# Altium schematic sheet Arduino_Uno_Custom_Schematic.SchDoc (part 2 of 4)
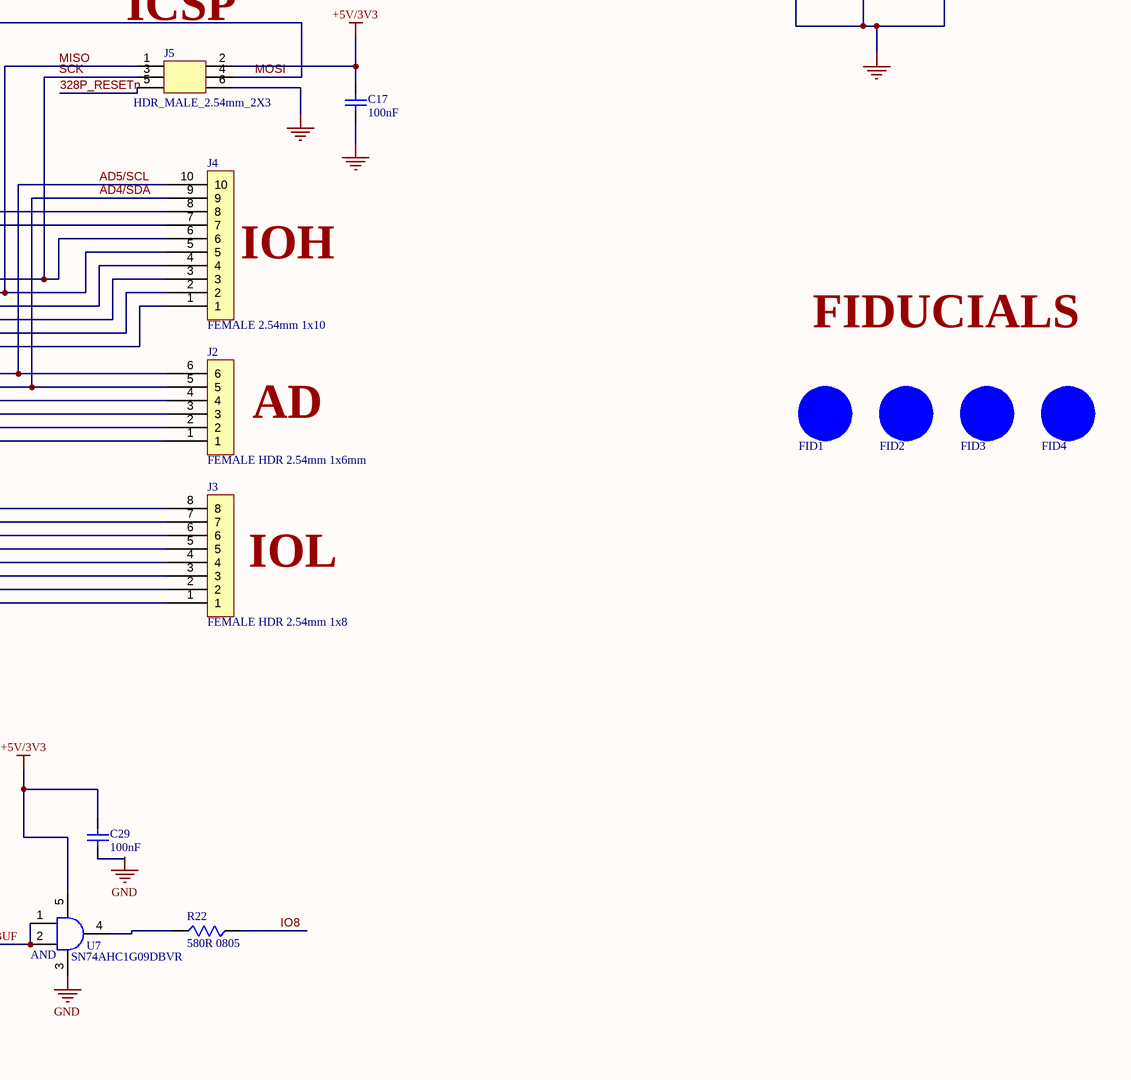
[diagram p4: Arduino_Uno_Custom_Schematic.SchDoc, bottom right]
## Library data of the parts
C1 C2 = EEE-1AA101WR: Radial Can - SMD ALUMINUM ELECTROLYTIC CAPACITOR S 10V 100muF ±20% 0.197Dia 5.00mm; Manufacturer: Panasonic; Manufacturer Lifecycle Status: NRFND; Value: 100µF; Dissipation Factor: 30%; Leakage Current: 10µA; Life (Hours): 1000hours; Ripple Current: 54mA; Ripple Current (AC): 50mA; Supplier: DigiKey; Supplier Part Number: PCE3867CT-ND; Manufacturer Part Number: EEE-1AA101WR; RoHS: Compliant; Category: Aluminum Electrolytic Capacitors; Stock: 21585; Pricing: 1=0.37, 10=0.228, 50=0.1668, 100=0.1474, 500=0.1137 (USD); Case/Package: Radial; Contact Plating: Tin; Country of Origin: Japan, Malaysia; Diameter: 5mm; Export Control Classification Number (ECCN) Code: EAR99; Height: 5.4mm; Height - Seated (Max): 5.4102mm; Harmonized Tariff Schedule (HTS) Code: 8532.22.00.20; Introduction Date: 2004-07-05; Lead Free: Lead Free; Length: 5.4mm; Lifecycle Status: NRND; Max Operating Temperature: 85°C; Min Operating Temperature: -40°C; Mounting Technology: Surface Mount; Number of Terminals: 2; Packaging: Cut Tape; Radiation Hardening: No; Ratings: AEC-Q200; REACH SVHC: Yes; Schedule B: 8532220020, 8532220020|8532220020|8532220020|8532220020|8532220020; Part Series: S; Termination: SMD/SMT; Tolerance: 20%; Voltage Rating: 10V; Voltage Rating (DC): 10V; Width: 5.3mm; ComponentLink1URL: https://datasheet.octopart.com:443/EEE-1AA101WR-Panasonic-datasheet-62330071.pdf?src-supplier=Newark; ComponentLink1Description: https://datasheet.octopart.com:443/EEE-1AA101WR-Panasonic-datasheet-62330071.pdf?src-supplier=Newark; ComponentLink2URL: https://datasheet.octopart.com:443/EEE-1AA101WR-Panasonic-datasheet-5314063.pdf?src-supplier=Newark; ComponentLink2Description: https://datasheet.octopart.com:443/EEE-1AA101WR-Panasonic-datasheet-5314063.pdf?src-supplier=Newark; ComponentLink3URL: https://datasheet.octopart.com:443/EEE-1AA101WR-Panasonic-datasheet-41169183.pdf?src-supplier=Newark; ComponentLink3Description: https://datasheet.octopart.com:443/EEE-1AA101WR-Panasonic-datasheet-41169183.pdf?src-supplier=Newark; ComponentLink4URL: https://datasheet.octopart.com:443/EEE-1AA101WR-Panasonic-datasheet-13265900.pdf?src-supplier=RS+(Formerly+Allied+Electronics); ComponentLink4Description: https://datasheet.octopart.com:443/EEE-1AA101WR-Panasonic-datasheet-13265900.pdf?src-supplier=RS+(Formerly+Allied+Electronics); ComponentLink5URL: https://datasheet.octopart.com:443/EEE-1AA101WR-Panasonic-datasheet-34230028.pdf?src-supplier=element14+APAC; ComponentLink5Description: https://datasheet.octopart.com:443/EEE-1AA101WR-Panasonic-datasheet-34230028.pdf?src-supplier=element14+APAC; ComponentLink6URL: https://datasheet.octopart.com:443/EEE-1AA101WR-Panasonic-datasheet-154766114.pdf?src-supplier=Master+Electronics; ComponentLink6Description: https://datasheet.octopart.com:443/EEE-1AA101WR-Panasonic-datasheet-154766114.pdf?src-supplier=Master+Electronics; ComponentLink7URL: https://datasheet.octopart.com:443/EEE-1AA101WR-Panasonic-datasheet-11548988.pdf?src-supplier=Arrow+Electronics; ComponentLink7Description: https://datasheet.octopart.com:443/EEE-1AA101WR-Panasonic-datasheet-11548988.pdf?src-supplier=Arrow+Electronics; ComponentLink8URL: https://datasheet.octopart.com:443/EEE1AA101WR-Panasonic-datasheet-150469818.pdf?src-supplier=TME; ComponentLink8Description: https://datasheet.octopart.com:443/EEE1AA101WR-Panasonic-datasheet-150469818.pdf?src-supplier=TME; ComponentLink9URL: https://sigma.octopart.com:443/150570760/technical_drawing/Panasonic-EEE1AA101WR.pdf?src-supplier=Panasonic+SCT; ComponentLink9Description: https://sigma.octopart.com:443/150570760/technical_drawing/Panasonic-EEE1AA101WR.pdf?src-supplier=Panasonic+SCT; ComponentLink10URL: https://datasheet.octopart.com:443/EEE-1AA101WR-Panasonic-datasheet-6019.pdf?src-supplier=DigiKey; ComponentLink10Description: https://datasheet.octopart.com:443/EEE-1AA101WR-Panasonic-datasheet-6019.pdf?src-supplier=DigiKey
C3 C7 C12 C13 C19 C21 C22 C34 = C2012X5R1C106K085AC: 16V 10uF X5R 卤10% 0805 Multilayer Ceramic Capacitors MLCC - SMD/SMT ROHS; Manufacturer: TDK; Manufacturer Lifecycle Status: PRODUCTION (NOT RECOMMENDED FOR NEW DESIGN); Value: 10µF; Tolerance: 10%; Supplier: DigiKey; Supplier Part Number: 445-7644-1-ND; Manufacturer Part Number: C2012X5R1C106K085AC; RoHS: Compliant; Category: Ceramic Capacitors; Stock: 446443; Pricing: 1=0.21, 10=0.121, 50=0.0866, 100=0.076, 500=0.05824, 1000=0.05277 (USD); Case/Package: 0805; Case Code (Imperial): 0805; Case Code (Metric): 2012; China RoHS: Compliant; Composition: Ceramic; Depth: 1.25mm; Dielectric: X5R; Dielectric Material: Ceramic; Export Control Classification Number (ECCN) Code: EAR99; Height: 850µm; Harmonized Tariff Schedule (HTS) Code: 8532.24.00.20; Introduction Date: 2012-08-21; Lead Free: Lead Free; Length: 2mm; Lifecycle Status: NRND; Material: Ceramic; Max Length: 2.2mm; Max Operating Temperature: 85°C; Max Width: 1.45mm; Min Length: 1.8mm; Min Operating Temperature: -55°C; Min Width: 1.05mm; Mounting Technology: Surface Mount; Pins: 2; Number of Terminals: 2; REACH SVHC: Yes; Schedule B: 8532240020, 8532240020|8532240020|8532240020|8532240020|8532240020; Termination: SMD/SMT; Voltage Rating: 16V; Voltage Rating (DC): 16V; Weight: 5.499807mg; Width: 1.25mm; ComponentLink1URL: https://datasheet.octopart.com:443/C2012X5R1C106K085AC-TDK-datasheet-175423548.pdf?src-supplier=IHS; ComponentLink1Description: https://datasheet.octopart.com:443/C2012X5R1C106K085AC-TDK-datasheet-175423548.pdf?src-supplier=IHS; ComponentLink2URL: https://datasheet.octopart.com:443/C2012X5R1C106K085AC-TDK-datasheet-151546523.pdf?src-supplier=ODG+(Origin+Data+Global); ComponentLink2Description: https://datasheet.octopart.com:443/C2012X5R1C106K085AC-TDK-datasheet-151546523.pdf?src-supplier=ODG+(Origin+Data+Global); ComponentLink3URL: https://datasheet.octopart.com/C2012X5R1C106K085AC-TDK-datasheet-41194876.pdf; ComponentLink3Description: https://datasheet.octopart.com/C2012X5R1C106K085AC-TDK-datasheet-41194876.pdf; ComponentLink4URL: https://datasheet.octopart.com:443/C2012X5R1C106K085AC-TDK-datasheet-82475248.pdf?src-supplier=Newark; ComponentLink4Description: https://datasheet.octopart.com:443/C2012X5R1C106K085AC-TDK-datasheet-82475248.pdf?src-supplier=Newark; ComponentLink5URL: https://datasheet.octopart.com:443/C2012X5R1C106K085AC-TDK-datasheet-23766614.pdf?src-supplier=Newark; ComponentLink5Description: https://datasheet.octopart.com:443/C2012X5R1C106K085AC-TDK-datasheet-23766614.pdf?src-supplier=Newark; ComponentLink6URL: https://datasheet.octopart.com:443/C2012X5R1C106K085AC-TDK-datasheet-20681607.pdf?src-supplier=Newark; ComponentLink6Description: https://datasheet.octopart.com:443/C2012X5R1C106K085AC-TDK-datasheet-20681607.pdf?src-supplier=Newark; ComponentLink7URL: https://datasheet.octopart.com:443/C2012X5R1C106K085AC-TDK-datasheet-13444418.pdf?src-supplier=Newark; ComponentLink7Description: https://datasheet.octopart.com:443/C2012X5R1C106K085AC-TDK-datasheet-13444418.pdf?src-supplier=Newark; ComponentLink8URL: https://datasheet.octopart.com:443/C2012X5R1C106K085AC-TDK-datasheet-12509848.pdf?src-supplier=Future+Electronics; ComponentLink8Description: https://datasheet.octopart.com:443/C2012X5R1C106K085AC-TDK-datasheet-12509848.pdf?src-supplier=Future+Electronics; ComponentLink9URL: https://datasheet.octopart.com:443/C2012X5R1C106K085AC-TDK-datasheet-10978788.pdf?src-supplier=Future+Electronics; ComponentLink9Description: https://datasheet.octopart.com:443/C2012X5R1C106K085AC-TDK-datasheet-10978788.pdf?src-supplier=Future+Electronics; ComponentLink10URL: https://datasheet.octopart.com:443/C2012X5R1C106K085AC-TDK-datasheet-8852320.pdf?src-supplier=Future+Electronics; ComponentLink10Description: https://datasheet.octopart.com:443/C2012X5R1C106K085AC-TDK-datasheet-8852320.pdf?src-supplier=Future+Electronics; ComponentLink11URL: https://datasheet.octopart.com:443/C2012X5R1C106K085AC-TDK-datasheet-8359770.pdf?src-supplier=Future+Electronics; ComponentLink11Description: https://datasheet.octopart.com:443/C2012X5R1C106K085AC-TDK-datasheet-8359770.pdf?src-supplier=Future+Electronics; ComponentLink12URL: https://datasheet.octopart.com:443/C2012X5R1C106K085AC-TDK-datasheet-8324322.pdf?src-supplier=Future+Electronics; ComponentLink12Description: https://datasheet.octopart.com:443/C2012X5R1C106K085AC-TDK-datasheet-8324322.pdf?src-supplier=Future+Electronics; ComponentLink13URL: https://datasheet.octopart.com:443/C2012X5R1C106K085AC-TDK-datasheet-128946.pdf?src-supplier=Future+Electronics; ComponentLink13Description: https://datasheet.octopart.com:443/C2012X5R1C106K085AC-TDK-datasheet-128946.pdf?src-supplier=Future+Electronics
C4-C6 C8 C11 C14-C17 C20 C23 C24 C26 C28-C33 = C2012X7R1H104K085AA: C Series 0805 0.1 uF 50 V ±10 % Tolerance X7R SMT Multilayer Ceramic Capacitor; Manufacturer: TDK; Manufacturer Lifecycle Status: PRODUCTION (NOT RECOMMENDED FOR NEW DESIGN); Tolerance: 10%; Voltage: 50V; Supplier: DigiKey; Manufacturer Part Number: C2012X7R1H104K085AA; RoHS: Compliant; Category: Ceramic Capacitors; Stock: 478758; Pricing: 1=0.12, 10=0.069, 50=0.0482, 100=0.0418, 500=0.03104, 1000=0.02773 (USD); Case/Package: 0805; Case Code (Imperial): 0805; Case Code (Metric): 2012; China RoHS: Compliant; Composition: Ceramic; Depth: 1.25mm; Dielectric: X7R; Dielectric Material: Ceramic; Export Control Classification Number (ECCN) Code: EAR99; Height: 850µm; Harmonized Tariff Schedule (HTS) Code: 8532.24.00.20; Introduction Date: 2012-08-21; Lead Free: Lead Free; Length: 2mm; Lifecycle Status: NRND; Material: Ceramic; Max Length: 2.2mm; Max Operating Temperature: 125°C; Max Width: 1.45mm; Min Length: 1.8mm; Min Operating Temperature: -55°C; Min Width: 1.05mm; Mounting Technology: Surface Mount; Pins: 2; Number of Terminals: 2; Radiation Hardening: No; REACH SVHC: Yes; Schedule B: 8532240020, 8532240020|8532240020|8532240020|8532240020|8532240020; Termination: SMD/SMT; Voltage Rating: 50V; Voltage Rating (DC): 50V; Weight: 5.499807mg; Width: 1.25mm; ComponentLink1URL: https://datasheet.octopart.com:443/C2012X7R1H104K085AA-TDK-datasheet-175423548.pdf?src-supplier=IHS; ComponentLink1Description: https://datasheet.octopart.com:443/C2012X7R1H104K085AA-TDK-datasheet-175423548.pdf?src-supplier=IHS; ComponentLink2URL: https://datasheet.octopart.com:443/C2012X7R1H104K085AA-TDK-datasheet-151546523.pdf?src-supplier=ODG+(Origin+Data+Global); ComponentLink2Description: https://datasheet.octopart.com:443/C2012X7R1H104K085AA-TDK-datasheet-151546523.pdf?src-supplier=ODG+(Origin+Data+Global); ComponentLink3URL: https://datasheet.octopart.com:443/C2012X7R1H104K085AA-TDK-datasheet-41194876.pdf?src-supplier=element14+APAC; ComponentLink3Description: https://datasheet.octopart.com:443/C2012X7R1H104K085AA-TDK-datasheet-41194876.pdf?src-supplier=element14+APAC; ComponentLink4URL: https://datasheet.octopart.com:443/C2012X7R1H104K085AA-TDK-datasheet-10978788.pdf?src-supplier=element14+APAC; ComponentLink4Description: https://datasheet.octopart.com:443/C2012X7R1H104K085AA-TDK-datasheet-10978788.pdf?src-supplier=element14+APAC; ComponentLink5URL: https://datasheet.octopart.com:443/C2012X7R1H104K085AA-TDK-datasheet-13376850.pdf?src-supplier=element14+APAC; ComponentLink5Description: https://datasheet.octopart.com:443/C2012X7R1H104K085AA-TDK-datasheet-13376850.pdf?src-supplier=element14+APAC; ComponentLink6URL: https://datasheet.octopart.com:443/C2012X7R1H104K085AA-TDK-datasheet-41169347.pdf?src-supplier=element14+APAC; ComponentLink6Description: https://datasheet.octopart.com:443/C2012X7R1H104K085AA-TDK-datasheet-41169347.pdf?src-supplier=element14+APAC; ComponentLink7URL: https://datasheet.octopart.com:443/C2012X7R1H104K085AA-TDK-datasheet-82475248.pdf?src-supplier=Newark; ComponentLink7Description: https://datasheet.octopart.com:443/C2012X7R1H104K085AA-TDK-datasheet-82475248.pdf?src-supplier=Newark; ComponentLink8URL: https://datasheet.octopart.com:443/C2012X7R1H104K085AA-TDK-datasheet-13444418.pdf?src-supplier=Newark; ComponentLink8Description: https://datasheet.octopart.com:443/C2012X7R1H104K085AA-TDK-datasheet-13444418.pdf?src-supplier=Newark; ComponentLink9URL: https://datasheet.octopart.com:443/C2012X7R1H104K085AA-TDK-datasheet-23766614.pdf?src-supplier=Newark; ComponentLink9Description: https://datasheet.octopart.com:443/C2012X7R1H104K085AA-TDK-datasheet-23766614.pdf?src-supplier=Newark; ComponentLink10URL: https://datasheet.octopart.com:443/C2012X7R1H104K085AA-TDK-datasheet-12509848.pdf?src-supplier=Future+Electronics; ComponentLink10Description: https://datasheet.octopart.com:443/C2012X7R1H104K085AA-TDK-datasheet-12509848.pdf?src-supplier=Future+Electronics; ComponentLink11URL: https://datasheet.octopart.com:443/C2012X7R1H104K085AA-TDK-datasheet-8852320.pdf?src-supplier=Future+Electronics; ComponentLink11Description: https://datasheet.octopart.com:443/C2012X7R1H104K085AA-TDK-datasheet-8852320.pdf?src-supplier=Future+Electronics; ComponentLink12URL: https://datasheet.octopart.com:443/C2012X7R1H104K085AA-TDK-datasheet-8359770.pdf?src-supplier=Future+Electronics; ComponentLink12Description: https://datasheet.octopart.com:443/C2012X7R1H104K085AA-TDK-datasheet-8359770.pdf?src-supplier=Future+Electronics; ComponentLink13URL: https://datasheet.octopart.com:443/C2012X7R1H104K085AA-TDK-datasheet-8324322.pdf?src-supplier=Future+Electronics; ComponentLink13Description: https://datasheet.octopart.com:443/C2012X7R1H104K085AA-TDK-datasheet-8324322.pdf?src-supplier=Future+Electronics; ComponentLink14URL: https://datasheet.octopart.com:443/C2012X7R1H104K085AA-TDK-datasheet-128946.pdf?src-supplier=Future+Electronics; ComponentLink14Description: https://datasheet.octopart.com:443/C2012X7R1H104K085AA-TDK-datasheet-128946.pdf?src-supplier=Future+Electronics; ComponentLink15URL: https://datasheet.octopart.com:443/C2012X7R1H104K085AA-TDK-datasheet-11730548.pdf?src-supplier=Electro+Sonic; ComponentLink15Description: https://datasheet.octopart.com:443/C2012X7R1H104K085AA-TDK-datasheet-11730548.pdf?src-supplier=Electro+Sonic; Value: 100nF; Supplier Part Number: 445-7534-1-ND
C9 C10 C25 C27 = C0805C180J5GACTU: SMD Comm C0G 0805 (2012Metric) Ceramic Capacitor 0.079Lx0.049W 2.00mmx1.25mm C0G NP0 ±5% 18pF; Manufacturer: Yageo Group; Dissipation Factor: 0.1%; Temperature Coefficient: 30ppm/°C; Voltage: 50V; Supplier: DigiKey; Supplier Part Number: 399-C0805C180J5GACTUCT-ND; Manufacturer Part Number: C0805C180J5GACTU; RoHS: Compliant; Category: Ceramic Capacitors; Stock: 106114; Pricing: 1=0.11, 10=0.06, 50=0.0414, 100=0.0358, 500=0.0264, 1000=0.0235 (USD); Value: 18pF; Case/Package: 0805; Case Code (Imperial): 0805; China RoHS: Compliant; Contact Material: Tin; Country of Origin: Mexico; Depth: 1.25mm; Dielectric: C0G; Dielectric Material: Ceramic; Export Control Classification Number (ECCN) Code: EAR99; Height: 780µm; Harmonized Tariff Schedule (HTS) Code: 8532.24.00.20; Introduction Date: 1997-02-01; Lead Free: Lead Free; Lead Pitch: 750µm; Length: 2mm; Lifecycle Status: Production; Material: Ceramic; Max Operating Temperature: 125°C; Min Operating Temperature: -55°C; Mounting Technology: Surface Mount; Pins: 2; Number of Terminals: 2; Packaging: Cut Tape; Radiation Hardening: No; REACH SVHC: Yes; Schedule B: 8532240020, 8532240020|8532240020, 8532240020|8532240020|8532240020, 8532240020|8532240020|8532240020|8532240020; Termination: SMD/SMT; Thickness: 889µm; Tolerance: 5%; Voltage Rating: 50V; Voltage Rating (AC): 50V; Voltage Rating (DC): 50V; Width: 1.25mm; ComponentLink1URL: https://datasheet.octopart.com:443/C0805C180J5GACTU-KEMET-datasheet-178132257.pdf?src-supplier=IHS; ComponentLink1Description: https://datasheet.octopart.com:443/C0805C180J5GACTU-KEMET-datasheet-178132257.pdf?src-supplier=IHS; ComponentLink2URL: https://datasheet.octopart.com:443/C0805C180J5GACTU-KEMET-datasheet-68331921.pdf?src-supplier=element14+APAC; ComponentLink2Description: https://datasheet.octopart.com:443/C0805C180J5GACTU-KEMET-datasheet-68331921.pdf?src-supplier=element14+APAC; ComponentLink3URL: https://datasheet.octopart.com:443/C0805C180J5GACTU-Kemet-datasheet-10282724.pdf?src-supplier=element14+APAC; ComponentLink3Description: https://datasheet.octopart.com:443/C0805C180J5GACTU-Kemet-datasheet-10282724.pdf?src-supplier=element14+APAC; ComponentLink4URL: https://datasheet.octopart.com:443/C0805C180J5GACTU-KEMET-datasheet-176142321.pdf?src-supplier=element14+APAC; ComponentLink4Description: https://datasheet.octopart.com:443/C0805C180J5GACTU-KEMET-datasheet-176142321.pdf?src-supplier=element14+APAC; ComponentLink5URL: https://datasheet.octopart.com:443/C0805C180J5GACTU-KEMET-datasheet-176142314.pdf?src-supplier=element14+APAC; ComponentLink5Description: https://datasheet.octopart.com:443/C0805C180J5GACTU-KEMET-datasheet-176142314.pdf?src-supplier=element14+APAC; ComponentLink6URL: https://datasheet.octopart.com:443/C0805C180J5GACTU-KEMET-datasheet-149524055.pdf?src-supplier=Farnell; ComponentLink6Description: https://datasheet.octopart.com:443/C0805C180J5GACTU-KEMET-datasheet-149524055.pdf?src-supplier=Farnell; ComponentLink7URL: https://datasheet.octopart.com:443/C0805C180J5GACTU-Kemet-datasheet-21202491.pdf?src-supplier=Farnell; ComponentLink7Description: https://datasheet.octopart.com:443/C0805C180J5GACTU-Kemet-datasheet-21202491.pdf?src-supplier=Farnell; ComponentLink8URL: https://datasheet.octopart.com:443/C0805C180J5GACTU-KEMET-datasheet-101576200.pdf?src-supplier=Farnell; ComponentLink8Description: https://datasheet.octopart.com:443/C0805C180J5GACTU-KEMET-datasheet-101576200.pdf?src-supplier=Farnell; ComponentLink9URL: https://datasheet.octopart.com:443/C0805C180J5GACTU-Kemet-datasheet-7833651.pdf?src-supplier=Farnell; ComponentLink9Description: https://datasheet.octopart.com:443/C0805C180J5GACTU-Kemet-datasheet-7833651.pdf?src-supplier=Farnell; ComponentLink10URL: https://datasheet.octopart.com:443/C0805C180J5GACTU-Kemet-datasheet-7601896.pdf?src-supplier=Farnell; ComponentLink10Description: https://datasheet.octopart.com:443/C0805C180J5GACTU-Kemet-datasheet-7601896.pdf?src-supplier=Farnell; ComponentLink11URL: https://datasheet.octopart.com:443/C0805C180J5GACTU-Kemet-datasheet-5316294.pdf?src-supplier=Farnell; ComponentLink11Description: https://datasheet.octopart.com:443/C0805C180J5GACTU-Kemet-datasheet-5316294.pdf?src-supplier=Farnell; ComponentLink12URL: https://datasheet.octopart.com:443/C0805C180J5GACTU-Kemet-datasheet-5314837.pdf?src-supplier=Farnell; ComponentLink12Description: https://datasheet.octopart.com:443/C0805C180J5GACTU-Kemet-datasheet-5314837.pdf?src-supplier=Farnell; ComponentLink13URL: https://datasheet.octopart.com:443/C0805C180J5GACTU-Kemet-datasheet-8092359.pdf?src-supplier=Farnell; ComponentLink13Description: https://datasheet.octopart.com:443/C0805C180J5GACTU-Kemet-datasheet-8092359.pdf?src-supplier=Farnell; ComponentLink14URL: https://datasheet.octopart.com:443/C0805C180J5GACTU-Kemet-datasheet-5313890.pdf?src-supplier=Farnell; ComponentLink14Description: https://datasheet.octopart.com:443/C0805C180J5GACTU-Kemet-datasheet-5313890.pdf?src-supplier=Farnell; ComponentLink15URL: https://datasheet.octopart.com:443/C0805C180J5GACTU-Kemet-datasheet-5390537.pdf?src-supplier=Farnell; ComponentLink15Description: https://datasheet.octopart.com:443/C0805C180J5GACTU-Kemet-datasheet-5390537.pdf?src-supplier=Farnell; ComponentLink16URL: https://datasheet.octopart.com:443/C0805C180J5GACTU-Kemet-datasheet-5314969.pdf?src-supplier=Farnell; ComponentLink16Description: https://datasheet.octopart.com:443/C0805C180J5GACTU-Kemet-datasheet-5314969.pdf?src-supplier=Farnell; ComponentLink17URL: https://datasheet.octopart.com:443/C0805C180J5GACTU-Kemet-datasheet-5314627.pdf?src-supplier=Farnell; ComponentLink17Description: https://datasheet.octopart.com:443/C0805C180J5GACTU-Kemet-datasheet-5314627.pdf?src-supplier=Farnell; ComponentLink18URL: https://datasheet.octopart.com:443/C0805C180J5GACTU-Kemet-datasheet-5389132.pdf?src-supplier=Farnell; ComponentLink18Description: https://datasheet.octopart.com:443/C0805C180J5GACTU-Kemet-datasheet-5389132.pdf?src-supplier=Farnell; ComponentLink19URL: https://datasheet.octopart.com:443/C0805C180J5GACTU-Kemet-datasheet-5313836.pdf?src-supplier=Farnell; ComponentLink19Description: https://datasheet.octopart.com:443/C0805C180J5GACTU-Kemet-datasheet-5313836.pdf?src-supplier=Farnell; ComponentLink20URL: https://datasheet.octopart.com:443/C0805C180J5GACTU-Kemet-datasheet-8111010.pdf?src-supplier=Farnell; ComponentLink20Description: https://datasheet.octopart.com:443/C0805C180J5GACTU-Kemet-datasheet-8111010.pdf?src-supplier=Farnell; ComponentLink21URL: https://datasheet.octopart.com:443/C0805C180J5GACTU-Kemet-datasheet-7541751.pdf?src-supplier=Farnell; ComponentLink21Description: https://datasheet.octopart.com:443/C0805C180J5GACTU-Kemet-datasheet-7541751.pdf?src-supplier=Farnell; ComponentLink22URL: https://datasheet.octopart.com:443/C0805C180J5GACTU-Kemet-datasheet-7627733.pdf?src-supplier=Farnell; ComponentLink22Description: https://datasheet.octopart.com:443/C0805C180J5GACTU-Kemet-datasheet-7627733.pdf?src-supplier=Farnell; ComponentLink23URL: https://datasheet.octopart.com:443/C0805C180J5GACTU-Kemet-datasheet-500041.pdf?src-supplier=Farnell; ComponentLink23Description: https://datasheet.octopart.com:443/C0805C180J5GACTU-Kemet-datasheet-500041.pdf?src-supplier=Farnell; ComponentLink24URL: https://datasheet.octopart.com:443/C0805C180J5GACTU-Kemet-datasheet-5315946.pdf?src-supplier=Farnell; ComponentLink24Description: https://datasheet.octopart.com:443/C0805C180J5GACTU-Kemet-datasheet-5315946.pdf?src-supplier=Farnell; ComponentLink25URL: https://datasheet.octopart.com:443/C0805C180J5GACTU-Kemet-datasheet-5314449.pdf?src-supplier=Newark; ComponentLink25Description: https://datasheet.octopart.com:443/C0805C180J5GACTU-Kemet-datasheet-5314449.pdf?src-supplier=Newark; ComponentLink26URL: https://datasheet.octopart.com:443/C0805C180J5GACTU-KEMET-datasheet-170667456.pdf?src-supplier=Newark; ComponentLink26Description: https://datasheet.octopart.com:443/C0805C180J5GACTU-KEMET-datasheet-170667456.pdf?src-supplier=Newark; ComponentLink27URL: https://datasheet.octopart.com:443/C0805C180J5GACTU-KEMET-datasheet-37178240.pdf?src-supplier=Electro+Sonic; ComponentLink27Description: https://datasheet.octopart.com:443/C0805C180J5GACTU-KEMET-datasheet-37178240.pdf?src-supplier=Electro+Sonic; ComponentLink28URL: https://datasheet.octopart.com:443/C0805C180J5GACTU-Kemet-datasheet-67847120.pdf?src-supplier=TME; ComponentLink28Description: https://datasheet.octopart.com:443/C0805C180J5GACTU-Kemet-datasheet-67847120.pdf?src-supplier=TME; ComponentLink29URL: https://datasheet.octopart.com/C0805C180J5GACTU-KEMET-datasheet-84169754.pdf; ComponentLink29Description: https://datasheet.octopart.com/C0805C180J5GACTU-KEMET-datasheet-84169754.pdf; ComponentLink30URL: https://datasheet.octopart.com:443/C0805C180J5GAC7800-KEMET-datasheet-164857143.pdf?src-supplier=Burklin+Elektronik; ComponentLink30Description: https://datasheet.octopart.com:443/C0805C180J5GAC7800-KEMET-datasheet-164857143.pdf?src-supplier=Burklin+Elektronik; ComponentLink31URL: https://datasheet.octopart.com:443/C0805C180J5GAC-TU-Kemet-datasheet-7585144.pdf?src-supplier=Jameco; ComponentLink31Description: https://datasheet.octopart.com:443/C0805C180J5GAC-TU-Kemet-datasheet-7585144.pdf?src-supplier=Jameco; ComponentLink32URL: https://datasheet.octopart.com:443/C0805C180J5GACTU-Kemet-datasheet-464.pdf?src-supplier=RS+(Formerly+Allied+Electronics); ComponentLink32Description: https://datasheet.octopart.com:443/C0805C180J5GACTU-Kemet-datasheet-464.pdf?src-supplier=RS+(Formerly+Allied+Electronics); ComponentLink33URL: http://sigma.octopart.com:80/conflict_mineral_statement/Yageo-company-3.pdf?src-supplier=Compliance+Statements; ComponentLink33Description: http://sigma.octopart.com:80/conflict_mineral_statement/Yageo-company-3.pdf?src-supplier=Compliance+Statements; ComponentLink34URL: http://sigma.octopart.com:80/rohs_statement/Yageo-company-2.pdf?src-supplier=Compliance+Statements; ComponentLink34Description: http://sigma.octopart.com:80/rohs_statement/Yageo-company-2.pdf?src-supplier=Compliance+Statements
D1 = LG L29K-G2J1-24-0-2-R18-Z: LED Uni-Color Green 572nm 2-Pin Chip 0603(1608Metric) T/R; Manufacturer: Osram; Supplier: DigiKey; Supplier Part Number: 475-LGL29K-G2J1-24-0-2-R18-ZCT-ND; Manufacturer Part Number: LG L29K-G2J1-24-0-2-R18-Z; Category: LEDs; Stock: 574715; Pricing: 1=0.33, 10=0.227, 100=0.1605, 500=0.13008, 1000=0.12004, 2000=0.11149 (USD)
D2-D4 = LO L29K-H2L1-24-0-2-R18-Z: Led Orange Diffused 0603 SMD; Manufacturer: Osram; Lens Style: Clear, Diffused; Supplier: DigiKey; Supplier Part Number: 475-LOL29K-H2L1-24-0-2-R18-ZCT-ND; Manufacturer Part Number: LO L29K-H2L1-24-0-2-R18-Z; RoHS: Compliant; Category: LEDs; Stock: 22927; Pricing: 1=0.27, 10=0.185, 100=0.1294, 500=0.10426, 1000=0.09592, 2000=0.08882 (USD); Lead Free: Lead Free
D5 D6 = CUS520,H3F: Rectifier Diode, Schottky, 1 Phase, 1 Element, 0.2A, 30V V(RRM), Silicon; Manufacturer: Toshiba; Average Rectified Current: 200mA; Value: 17pF; Element Configuration: Single; Max Forward Surge Current (Ifsm): 1A; Max Junction Temperature (Tj): 125°C; Max Power Dissipation: 150mW; Number of Elements: 1; Peak Reverse Current: 5µA; Supplier: DigiKey; Supplier Part Number: CUS520H3FCT-ND; Manufacturer Part Number: CUS520,H3F; RoHS: Compliant; Category: Rectifier Diodes; Stock: 620781; Pricing: 1=0.19, 10=0.107, 100=0.0697, 500=0.05072, 1000=0.04457 (USD); Contact Plating: Silver, Tin; Forward Current: 200mA; Height: 1.15mm; Lifecycle Status: Production; Max Operating Temperature: 100°C; Max Output current: 200mA; Max Repetitive Reverse Voltage (Vrrm): 30V; Max Reverse Voltage (DC): 30V; Min Operating Temperature: -40°C; Mounting Technology: Surface Mount; Pins: 2; Number of Terminals: 2; Packaging: Tape & Reel (TR); Peak Non-Repetitive Surge Current: 1A; REACH SVHC: Yes; Reverse Standoff Voltage: 30V; Reverse Voltage: 30V; Schedule B: 8541100070, 8541100070|8541100070|8541100070|8541100070|8541100070; ComponentLink1URL: https://datasheet.octopart.com:443/CUS520%2CH3F-Toshiba-datasheet-107241640.pdf?src-supplier=ODG+(Origin+Data+Global); ComponentLink1Description: https://datasheet.octopart.com:443/CUS520%2CH3F-Toshiba-datasheet-107241640.pdf?src-supplier=ODG+(Origin+Data+Global)
FB1-FB3 = MPZ2012S601ATD25: Ferrite Beads Multi-Layer Power 600Ohm 25% 100MHz 2A 0.1Ohm DCR 0805 Automotive T/R; Manufacturer: TDK; Manufacturer Lifecycle Status: PRODUCTION; DC Resistance (DCR): 100mΩ; Impedance: 600Ω; Number of Circuits: 1; Value: 100mΩ; Supplier: DigiKey; Supplier Part Number: 445-MPZ2012S601ATD25CT-ND; Manufacturer Part Number: MPZ2012S601ATD25; RoHS: Compliant; Category: Ferrite Beads and Chips; Stock: 52789; Pricing: 1=0.12, 10=0.082, 25=0.0712, 50=0.064, 100=0.0573, 250=0.04928, 500=0.04374, 1000=0.03864 (USD); Case/Package: 0805; Case Code (Imperial): 0805; Case Code (Metric): 2012; China RoHS: Compliant; Core Material: Ferrite; Current Rating: 2A; Export Control Classification Number (ECCN) Code: EAR99; Height: 850µm; Harmonized Tariff Schedule (HTS) Code: 8504.50.80.00; Introduction Date: 2013-12-04; Lead Free: Lead Free; Length: 2mm; Lifecycle Status: Production; Max Current Rating: 2A; Max DC Current: 2A; Max Length: 2.2mm; Max Operating Temperature: 125°C; Max Width: 1.45mm; Min Length: 1.8mm; Min Operating Temperature: -55°C; Min Width: 1.05mm; Mounting Technology: Surface Mount; Number of Lines: 1; Number of Terminals: 2; Packaging: Cut Tape (CT); Ratings: AEC-Q200; REACH SVHC: Yes; RMS Current (Irms): 2A; Schedule B: 8504500000, 8504500000|8504500000|8504500000|8504500000|8504500000; ESR: 100mΩ; Termination: SMD/SMT; Test Frequency: 100MHz; Tolerance: 25%; Weight: 5.499807mg; Width: 1.25mm; ComponentLink1URL: https://datasheet.octopart.com:443/MPZ2012S601ATD25-TDK-datasheet-181268484.pdf?src-supplier=IHS; ComponentLink1Description: https://datasheet.octopart.com:443/MPZ2012S601ATD25-TDK-datasheet-181268484.pdf?src-supplier=IHS; ComponentLink2URL: https://datasheet.octopart.com:443/MPZ2012S601ATD25-TDK-datasheet-56871343.pdf?src-supplier=Upverter; ComponentLink2Description: https://datasheet.octopart.com:443/MPZ2012S601ATD25-TDK-datasheet-56871343.pdf?src-supplier=Upverter; ComponentLink3URL: https://datasheet.octopart.com:443/MPZ2012S601ATD25-TDK-datasheet-155380321.pdf?src-supplier=TDK; ComponentLink3Description: https://datasheet.octopart.com:443/MPZ2012S601ATD25-TDK-datasheet-155380321.pdf?src-supplier=TDK; ComponentLink4URL: https://datasheet.octopart.com:443/MPZ2012S601ATD25-TDK-datasheet-99917311.pdf?src-supplier=Farnell; ComponentLink4Description: https://datasheet.octopart.com:443/MPZ2012S601ATD25-TDK-datasheet-99917311.pdf?src-supplier=Farnell; ComponentLink5URL: https://datasheet.octopart.com:443/MPZ2012S601ATD25-TDK-datasheet-45032850.pdf?src-supplier=Future+Electronics; ComponentLink5Description: https://datasheet.octopart.com:443/MPZ2012S601ATD25-TDK-datasheet-45032850.pdf?src-supplier=Future+Electronics
FID1-FID4 = FID_1MMC: Fiducial 40mil dia, 120mil mask
J1 J3 = M20-7820842: 2.54mm (0.1) Pitch SIL Vertical PC Tail Socket Assembly, selective gold + tin, 8 contacts"; Manufacturer: Harwin; Connector Type: Receptacle, Socket; Contact Resistance: 20mΩ; Current Rating: 3A; Dielectric Material: Polyamide; Insulation Resistance: 1GΩ; Number of Contacts: 8; Supplier: DigiKey; Supplier Part Number: 952-1823-ND; Manufacturer Part Number: M20-7820842; RoHS: Compliant; Category: Card Edge Connectors; Stock: 3340; Pricing: 1=1.27, 27=1.0063, 108=0.91231, 513=0.81725, 1026=0.77824, 5022=0.69577, 10017=0.66272 (USD); Case/Package: SIL; Color: Black; Contact Gender: Female; Contact Material: Bronze; Contact Plating: Gold, Tin; Country of Origin: Mainland China; Depth: 2.5mm; Export Control Classification Number (ECCN) Code: EAR99; Gender: Female; Housing Color: Black; Housing Material: Polyamide; Harmonized Tariff Schedule (HTS) Code: 8536.69.40.40; Introduction Date: 2005-06-27; Length: 20.72mm; Lifecycle Status: Production; Max Current Rating: 3A; Max Operating Temperature: 105°C; Min Operating Temperature: -40°C; Mounting Technology: Through Hole; Pins: 8; Number of Positions: 8; Number of Rows: 1; Orientation: Straight; Pitch: 2.54mm; Radiation Hardening: No; REACH SVHC: Yes; Terminal Pitch: 2.54mm; Termination: Solder; Weight: 719.992839mg; ComponentLink1URL: https://datasheet.octopart.com:443/M20-7820842-Harwin-datasheet-176383844.pdf?src-supplier=Newark; ComponentLink1Description: https://datasheet.octopart.com:443/M20-7820842-Harwin-datasheet-176383844.pdf?src-supplier=Newark; ComponentLink2URL: https://datasheet.octopart.com:443/M20-7820842-Harwin-datasheet-99119574.pdf?src-supplier=HQonline; ComponentLink2Description: https://datasheet.octopart.com:443/M20-7820842-Harwin-datasheet-99119574.pdf?src-supplier=HQonline; ComponentLink3URL: http://sigma.octopart.com:80/15888290/rohs_statement/Harwin-M20-7820842.pdf?src-supplier=Compliance+Statements; ComponentLink3Description: http://sigma.octopart.com:80/15888290/rohs_statement/Harwin-M20-7820842.pdf?src-supplier=Compliance+Statements
J2 = M20-7820646: Conn Socket Strip Receptacle 6 Position 2.54mm Solder Straight Through Hole Tube; Manufacturer: Harwin; Connector Type: Receptacle, Socket; Contact Resistance: 20mΩ; Current Rating: 3A; Dielectric Material: Polyamide; Insulation Resistance: 1GΩ; Number of Contacts: 6; Supplier: DigiKey; Supplier Part Number: 952-1809-ND; Manufacturer Part Number: M20-7820646; RoHS: Compliant; Category: Card Edge Connectors; Stock: 1304; Pricing: 1=1.11, 36=0.86417, 108=0.79954, 504=0.7171, 1008=0.68287, 5004=0.60989, 10008=0.58081 (USD); Case/Package: SIL; Color: Black; Contact Gender: Female; Contact Material: Bronze; Contact Plating: Tin; Country of Origin: Mainland China; Depth: 2.5mm; Export Control Classification Number (ECCN) Code: EAR99; Gender: Female; Housing Color: Black; Housing Material: Nylon; Harmonized Tariff Schedule (HTS) Code: 8536.69.40.40; Introduction Date: 2005-06-27; Length: 15.64mm; Lifecycle Status: Production; Max Current Rating: 3A; Max Operating Temperature: 105°C; Min Operating Temperature: -40°C; Mounting Technology: Through Hole; Pins: 6; Number of Positions: 6; Number of Rows: 1; Orientation: Straight; Pitch: 2.54mm; Radiation Hardening: No; REACH SVHC: Yes; Terminal Pitch: 2.54mm; Termination: Solder; ComponentLink1URL: https://datasheet.octopart.com:443/M20-7820646-Harwin-datasheet-176383844.pdf?src-supplier=Newark; ComponentLink1Description: https://datasheet.octopart.com:443/M20-7820646-Harwin-datasheet-176383844.pdf?src-supplier=Newark; ComponentLink2URL: https://datasheet.octopart.com:443/M20-7820646-Harwin-datasheet-99119574.pdf?src-supplier=HQonline; ComponentLink2Description: https://datasheet.octopart.com:443/M20-7820646-Harwin-datasheet-99119574.pdf?src-supplier=HQonline; ComponentLink3URL: https://datasheet.octopart.com:443/M20-7820646-Harwin-datasheet-188872139.pdf?src-supplier=TME; ComponentLink3Description: https://datasheet.octopart.com:443/M20-7820646-Harwin-datasheet-188872139.pdf?src-supplier=TME; ComponentLink4URL: https://datasheet.octopart.com:443/M20-7820646-Harwin-datasheet-137074310.pdf?src-supplier=X-ON; ComponentLink4Description: https://datasheet.octopart.com:443/M20-7820646-Harwin-datasheet-137074310.pdf?src-supplier=X-ON; ComponentLink5URL: http://sigma.octopart.com:80/15888285/rohs_statement/Harwin-M20-7820646.pdf?src-supplier=Compliance+Statements; ComponentLink5Description: http://sigma.octopart.com:80/15888285/rohs_statement/Harwin-M20-7820646.pdf?src-supplier=Compliance+Statements
J4 = M20-7821046: Conn Socket Strip Receptacle 10 Position 2.54mm Solder Straight Through Hole Tube; Manufacturer: Harwin; Connector Type: Receptacle, Socket; Contact Resistance: 20mΩ; Current Rating: 3A; Dielectric Material: Polyamide; Hole Diameter: 800µm; Insulation Resistance: 1GΩ; Number of Contacts: 10; Operating Force: 4.8928N; Supplier: Newark; Supplier Part Number: M20-7821046; Manufacturer Part Number: M20-7821046; RoHS: Compliant; Category: Card Edge Connectors; Stock: 1798; Pricing: 1=2.12, 10=1.94, 100=1.74, 250=1.57, 500=1.51, 1000=1.44, 2500=1.38 (CAD); Case/Package: SIL; Color: Black; Contact Gender: Female; Contact Material: Bronze; Contact Plating: Tin; Depth: 2.5mm; Gender: Female; Housing Color: Black; Housing Material: Polyamide; Lead Pitch: 2.54mm; Length: 25.8mm; Lifecycle Status: Production; Max Current Rating: 3A; Max Operating Temperature: 105°C; Min Operating Temperature: -40°C; Mounting Technology: Through Hole; Pins: 10; Number of Positions: 10; Number of Rows: 1; Orientation: Straight; Pitch: 2.54mm; Radiation Hardening: No; REACH SVHC: Yes; Terminal Pitch: 2.54mm; Termination: Solder; ComponentLink1URL: https://datasheet.octopart.com:443/M20-7821046-Harwin-datasheet-176383844.pdf?src-supplier=Electro+Sonic; ComponentLink1Description: https://datasheet.octopart.com:443/M20-7821046-Harwin-datasheet-176383844.pdf?src-supplier=Electro+Sonic; ComponentLink2URL: https://datasheet.octopart.com:443/M20-7821046-Harwin-datasheet-99119574.pdf?src-supplier=Upverter; ComponentLink2Description: https://datasheet.octopart.com:443/M20-7821046-Harwin-datasheet-99119574.pdf?src-supplier=Upverter; ComponentLink3URL: https://datasheet.octopart.com:443/M20-7821046-Harwin-datasheet-526273.pdf?src-supplier=Upverter; ComponentLink3Description: https://datasheet.octopart.com:443/M20-7821046-Harwin-datasheet-526273.pdf?src-supplier=Upverter; ComponentLink4URL: https://datasheet.octopart.com:443/M20-7821046-Harwin-datasheet-96624206.pdf?src-supplier=element14+APAC; ComponentLink4Description: https://datasheet.octopart.com:443/M20-7821046-Harwin-datasheet-96624206.pdf?src-supplier=element14+APAC; ComponentLink5URL: https://datasheet.octopart.com:443/M20-7821046-Harwin-datasheet-6396485.pdf?src-supplier=Newark; ComponentLink5Description: https://datasheet.octopart.com:443/M20-7821046-Harwin-datasheet-6396485.pdf?src-supplier=Newark; ComponentLink6URL: https://datasheet.octopart.com:443/M20-7821046-Harwin-datasheet-32864534.pdf?src-supplier=Newark; ComponentLink6Description: https://datasheet.octopart.com:443/M20-7821046-Harwin-datasheet-32864534.pdf?src-supplier=Newark; ComponentLink7URL: https://datasheet.octopart.com:443/M20-7821046-Harwin-datasheet-15888280.pdf?src-supplier=Newark; ComponentLink7Description: https://datasheet.octopart.com:443/M20-7821046-Harwin-datasheet-15888280.pdf?src-supplier=Newark; ComponentLink8URL: https://datasheet.octopart.com:443/M20-7821046-Harwin-datasheet-188872139.pdf?src-supplier=TME; ComponentLink8Description: https://datasheet.octopart.com:443/M20-7821046-Harwin-datasheet-188872139.pdf?src-supplier=TME; ComponentLink9URL: https://datasheet.octopart.com:443/M20-7821046-Harwin-datasheet-14706651.pdf?src-supplier=Farnell; ComponentLink9Description: https://datasheet.octopart.com:443/M20-7821046-Harwin-datasheet-14706651.pdf?src-supplier=Farnell; ComponentLink10URL: http://sigma.octopart.com:80/15888295/rohs_statement/Harwin-M20-7821046.pdf?src-supplier=Compliance+Statements; ComponentLink10Description: http://sigma.octopart.com:80/15888295/rohs_statement/Harwin-M20-7821046.pdf?src-supplier=Compliance+Statements
J5 J6 = 67997-106HLF: Conn Unshrouded Header HDR 6 POS 2.54mm Solder ST Top Entry Thru-Hole BergStik® Bag; Manufacturer: Amphenol Communications Solutions; Connector Type: Male Pin; Current Rating: 5A; Dielectric Material: Polyethylene; Gender: Male; Insulation Resistance: 5GΩ; Lead Length: 3.05mm; Mating Post Length: 5.84mm; Max Voltage Rating (AC): 1.5kV; Number of Contacts: 6; Supplier: DigiKey; Supplier Part Number: 609-3393-ND; Manufacturer Part Number: 67997-106HLF; RoHS: Compliant; Category: Headers and Wire Housings; Stock: 2731; Pricing: 1=0.61, 10=0.521, 400=0.40155, 800=0.38238, 1200=0.37158, 5200=0.33505, 10000=0.31995 (USD); China RoHS: Compliant; Color: Black; Contact Gender: Male; Contact Material: Bronze; Contact Mating Length: 5.842mm; Contact Plating: Gold; Depth: 4.83mm; Export Control Classification Number (ECCN) Code: EAR99; Flammability Rating: UL94 V-0; Housing Color: Black; Housing Material: Thermoplastic; Harmonized Tariff Schedule (HTS) Code: 8536.69.40.40; Introduction Date: 2005-07-24; Lead Free: Lead Free; Lead Pitch: 2.54mm; Length: 7.62mm; Lifecycle Status: Production; Max Operating Temperature: 130°C; Min Operating Temperature: -65°C; Mounting Technology: Through Hole; Pins: 6; Number of Positions: 6; Number of Rows: 2; Orientation: Straight; Pitch: 2.54mm; Radiation Hardening: No; REACH SVHC: Yes; Row Spacing: 2.54mm; Schedule B: 8535908040, 8535908040|8535908040|8535908040|8535908040|8535908040|8535908040|8535908040|8535908040|8535908040|8535908040|8535908040|8535908040|8535908040|8535908040|8535908040|8535908040|8535908040|8535908040|8535908040|8535908040|8535908040|8535908040|8535908040|85; Terminal Pitch: 2.54mm; Termination: Through Hole; Voltage Rating: 1.5kV; ComponentLink1URL: https://datasheet.octopart.com:443/67997-106HLF-Amphenol-Communications-Solutions-datasheet-10288749.pdf?src-supplier=Newark; ComponentLink1Description: https://datasheet.octopart.com:443/67997-106HLF-Amphenol-Communications-Solutions-datasheet-10288749.pdf?src-supplier=Newark; ComponentLink2URL: https://datasheet.octopart.com:443/67997-106HLF-Areva-datasheet-10052131.pdf?src-supplier=Newark; ComponentLink2Description: https://datasheet.octopart.com:443/67997-106HLF-Areva-datasheet-10052131.pdf?src-supplier=Newark; ComponentLink3URL: https://datasheet.octopart.com:443/67997-106HLF-Areva-datasheet-8877144.pdf?src-supplier=Newark; ComponentLink3Description: https://datasheet.octopart.com:443/67997-106HLF-Areva-datasheet-8877144.pdf?src-supplier=Newark; ComponentLink4URL: https://datasheet.octopart.com:443/67997-106HLF-Areva-datasheet-8731571.pdf?src-supplier=Newark; ComponentLink4Description: https://datasheet.octopart.com:443/67997-106HLF-Areva-datasheet-8731571.pdf?src-supplier=Newark; ComponentLink5URL: https://datasheet.octopart.com:443/67997-106HLF-Areva-datasheet-8486089.pdf?src-supplier=Newark; ComponentLink5Description: https://datasheet.octopart.com:443/67997-106HLF-Areva-datasheet-8486089.pdf?src-supplier=Newark; ComponentLink6URL: https://datasheet.octopart.com:443/67997-106HLF-Amphenol-ICC---FCI-datasheet-188474449.pdf?src-supplier=JRH+Electronics; ComponentLink6Description: https://datasheet.octopart.com:443/67997-106HLF-Amphenol-ICC---FCI-datasheet-188474449.pdf?src-supplier=JRH+Electronics; ComponentLink7URL: https://datasheet.octopart.com:443/67997-106HLF-Amphenol-Communications-Solutions-datasheet-36854132.pdf?src-supplier=Farnell; ComponentLink7Description: https://datasheet.octopart.com:443/67997-106HLF-Amphenol-Communications-Solutions-datasheet-36854132.pdf?src-supplier=Farnell; ComponentLink8URL: https://datasheet.octopart.com:443/67997-106HLF-Amphenol-Communications-Solutions-datasheet-20739478.pdf?src-supplier=RS+(Formerly+Allied+Electronics); ComponentLink8Description: https://datasheet.octopart.com:443/67997-106HLF-Amphenol-Communications-Solutions-datasheet-20739478.pdf?src-supplier=RS+(Formerly+Allied+Electronics); ComponentLink9URL: https://datasheet.octopart.com:443/67997-106HLF-Areva-datasheet-118652.pdf?src-supplier=DigiKey; ComponentLink9Description: https://datasheet.octopart.com:443/67997-106HLF-Areva-datasheet-118652.pdf?src-supplier=DigiKey
J7 = USB4085-GF-A: USB Connector, 16 Contact(s), Female, Right Angle, Solder Terminal, Locking, Receptacle; Manufacturer: Global Connector Technology; Contact Resistance: 50mΩ; Current Rating: 250mA; Dielectric Material: Liquid Crystal Polymer; Insulation Resistance: 100MΩ; Number of Contacts: 16; Number of Ports: 1; Operating Force: 20N; Row Spacing: 1.35mm; USB Standard: USB 2.0; Voltage Rating: 20V; Supplier: DigiKey; Supplier Part Number: 2073-USB4085-GF-ACT-ND; Manufacturer Part Number: USB4085-GF-A; RoHS: Compliant; Category: USB Connectors; Stock: 112079; Pricing: 1=0.91, 10=0.772, 25=0.7236, 50=0.689, 100=0.6561, 250=0.61492 (USD); China RoHS: Compliant; Contact Material: Gold, Nickel; Country of Origin: Mainland China; Export Control Classification Number (ECCN) Code: EAR99; Gender: Female; Height: 3.66mm; Harmonized Tariff Schedule (HTS) Code: 8536.69.40.30; Insulation Color: Black; Introduction Date: 2018-08-17; Lifecycle Status: Production; Max Operating Temperature: 85°C; Min Operating Temperature: -40°C; Pins: 16; Number of Positions: 16; Number of Rows: 2; Orientation: Right Angle; REACH SVHC: Yes; Shell Finish: Nickel; Shell Material: Stainless Steel; Terminal Pitch: 850µm; Termination: Solder; ComponentLink1URL: https://datasheet.octopart.com:443/USB4085-GF-A-GCT-datasheet-188869075.pdf?src-supplier=TME; ComponentLink1Description: https://datasheet.octopart.com:443/USB4085-GF-A-GCT-datasheet-188869075.pdf?src-supplier=TME; ComponentLink2URL: https://datasheet.octopart.com:443/USB4085-GF-A-GCT-datasheet-166929322.pdf?src-supplier=TME; ComponentLink2Description: https://datasheet.octopart.com:443/USB4085-GF-A-GCT-datasheet-166929322.pdf?src-supplier=TME; ComponentLink3URL: https://datasheet.octopart.com:443/USB4085-GF-A-Global-Connector-Technology-datasheet-155825551.pdf?src-supplier=Future+Electronics; ComponentLink3Description: https://datasheet.octopart.com:443/USB4085-GF-A-Global-Connector-Technology-datasheet-155825551.pdf?src-supplier=Future+Electronics; ComponentLink4URL: https://datasheet.octopart.com:443/USB4085-GF-A-Global-Connector-Technology-datasheet-115130528.pdf?src-supplier=Future+Electronics; ComponentLink4Description: https://datasheet.octopart.com:443/USB4085-GF-A-Global-Connector-Technology-datasheet-115130528.pdf?src-supplier=Future+Electronics
J8 J9 = PAD_WITH_HOLE_4MM_1.5MM: Pad with a hole 4mm * 1.5mm
JP1 JP4 = 68001-203HLF: Conn Unshrouded Header HDR 3 POS 2.54mm Solder ST Top Entry Thru-Hole BergStik® Bulk; Manufacturer: Amphenol Communications Solutions; Connector Type: Male Pin; Current Rating: 3A; Gender: Male; Insulation Resistance: 5GΩ; Lead Length: 3.05mm; Mating Post Length: 5.84mm; Max Voltage Rating (AC): 1.5kV; Number of Contacts: 3; Supplier: DigiKey; Supplier Part Number: 609-3470-ND; Manufacturer Part Number: 68001-203HLF; RoHS: Compliant; Category: Headers and Wire Housings; Stock: 58333; Pricing: 1=0.24, 10=0.2, 100=0.1697, 500=0.1514, 4000=0.13072, 8000=0.12448, 12000=0.12097 (USD); China RoHS: Compliant; Color: Black; Contact Gender: Male; Contact Material: Gold, Nickel; Contact Mating Length: 5.842mm; Contact Plating: Gold; Country of Origin: India; Depth: 2.41mm; Export Control Classification Number (ECCN) Code: EAR99; Flammability Rating: UL94 V-0; Height: 8.73mm; Housing Color: Black; Housing Material: Thermoplastic; Harmonized Tariff Schedule (HTS) Code: 8536.69.40.40; Introduction Date: 2002-04-24; Lead Pitch: 2.54mm; Length: 7.62mm; Lifecycle Status: Production; Max Operating Temperature: 130°C; Min Operating Temperature: -65°C; Mounting Technology: Through Hole; Pins: 3; Number of Positions: 3; Number of Rows: 1; Orientation: Straight; Packaging: Bulk; Pitch: 2.54mm; Radiation Hardening: No; REACH SVHC: Yes; Schedule B: 8535908040, 8535908040|8535908040, 8535908040|8535908040|8535908040, 8535908040|8535908040|8535908040|8535908040; Terminal Pitch: 2.54mm; Termination: Solder; Voltage Rating: 1.5kV; ComponentLink1URL: https://datasheet.octopart.com:443/68001-203HLF-Amphenol-Communications-Solutions-datasheet-100449246.pdf?src-supplier=Upverter; ComponentLink1Description: https://datasheet.octopart.com:443/68001-203HLF-Amphenol-Communications-Solutions-datasheet-100449246.pdf?src-supplier=Upverter; ComponentLink2URL: https://datasheet.octopart.com:443/68001-203HLF-Amphenol-Communications-Solutions-datasheet-151206381.pdf?src-supplier=Newark; ComponentLink2Description: https://datasheet.octopart.com:443/68001-203HLF-Amphenol-Communications-Solutions-datasheet-151206381.pdf?src-supplier=Newark; ComponentLink3URL: https://datasheet.octopart.com:443/68001-203HLF-Areva-datasheet-10088795.pdf?src-supplier=Newark; ComponentLink3Description: https://datasheet.octopart.com:443/68001-203HLF-Areva-datasheet-10088795.pdf?src-supplier=Newark; ComponentLink4URL: https://datasheet.octopart.com:443/68001-203HLF-Areva-datasheet-8861575.pdf?src-supplier=Newark; ComponentLink4Description: https://datasheet.octopart.com:443/68001-203HLF-Areva-datasheet-8861575.pdf?src-supplier=Newark; ComponentLink5URL: https://datasheet.octopart.com:443/68001-203HLF-Areva-datasheet-8713716.pdf?src-supplier=Newark; ComponentLink5Description: https://datasheet.octopart.com:443/68001-203HLF-Areva-datasheet-8713716.pdf?src-supplier=Newark; ComponentLink6URL: https://datasheet.octopart.com:443/68001-203HLF-Areva-datasheet-8449737.pdf?src-supplier=Newark; ComponentLink6Description: https://datasheet.octopart.com:443/68001-203HLF-Areva-datasheet-8449737.pdf?src-supplier=Newark; ComponentLink7URL: https://datasheet.octopart.com:443/68001-203HLF-Amphenol-Communications-Solutions-datasheet-41232361.pdf?src-supplier=Farnell; ComponentLink7Description: https://datasheet.octopart.com:443/68001-203HLF-Amphenol-Communications-Solutions-datasheet-41232361.pdf?src-supplier=Farnell; ComponentLink8URL: https://datasheet.octopart.com:443/68001-203HLF-Amphenol-Communications-Solutions-datasheet-154727322.pdf?src-supplier=Electro+Sonic; ComponentLink8Description: https://datasheet.octopart.com:443/68001-203HLF-Amphenol-Communications-Solutions-datasheet-154727322.pdf?src-supplier=Electro+Sonic; ComponentLink9URL: https://datasheet.octopart.com:443/68001-203HLF-Amphenol-Communications-Solutions-datasheet-20739500.pdf?src-supplier=RS+(Formerly+Allied+Electronics); ComponentLink9Description: https://datasheet.octopart.com:443/68001-203HLF-Amphenol-Communications-Solutions-datasheet-20739500.pdf?src-supplier=RS+(Formerly+Allied+Electronics)